# Altium schematic sheet [19]-CAMERA_PWR_CONNECTORS.SchDoc
size A4
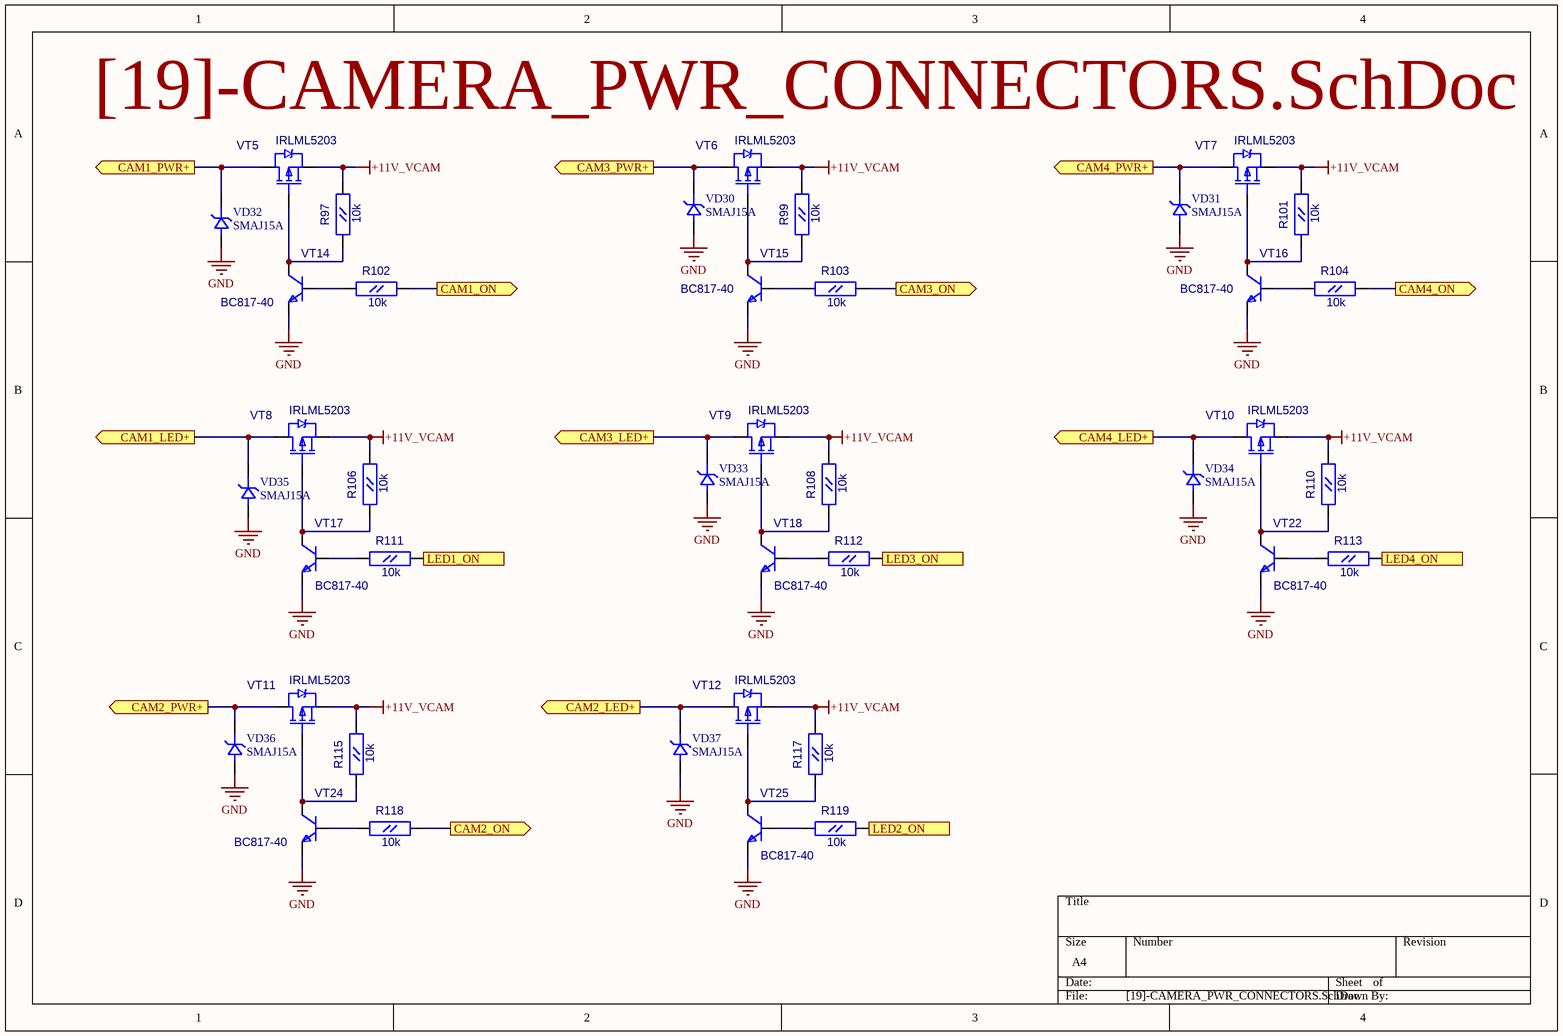
[diagram p0: [19]-CAMERA_PWR_CONNECTORS.SchDoc]

## Parts
R97  10k  [RC0603]
R99  10k  [RC0603]
R101  10k  [RC0603]
R102  10k  [RC0603]
R103  10k  [RC0603]
R104  10k  [RC0603]
R106  10k  [RC0603]
R108  10k  [RC0603]
R110  10k  [RC0603]
R111  10k  [RC0603]
R112  10k  [RC0603]
R113  10k  [RC0603]
R115  10k  [RC0603]
R117  10k  [RC0603]
R118  10k  [RC0603]
R119  10k  [RC0603]
VD30  SMAJ15A  [SMA]
VD31  SMAJ15A  [SMA]
VD32  SMAJ15A  [SMA]
VD33  SMAJ15A  [SMA]
VD34  SMAJ15A  [SMA]
VD35  SMAJ15A  [SMA]
VD36  SMAJ15A  [SMA]
VD37  SMAJ15A  [SMA]
VT5  IRLML5203  [SOT-23(123)]
VT6  IRLML5203  [SOT-23(123)]
VT7  IRLML5203  [SOT-23(123)]
VT8  IRLML5203  [SOT-23(123)]
VT9  IRLML5203  [SOT-23(123)]
VT10  IRLML5203  [SOT-23(123)]
VT11  IRLML5203  [SOT-23(123)]
VT12  IRLML5203  [SOT-23(123)]
VT14  BC817-40  [SOT-23(123)]
VT15  BC817-40  [SOT-23(123)]
VT16  BC817-40  [SOT-23(123)]
VT17  BC817-40  [SOT-23(123)]
VT18  BC817-40  [SOT-23(123)]
VT22  BC817-40  [SOT-23(123)]
VT24  BC817-40  [SOT-23(123)]
VT25  BC817-40  [SOT-23(123)]

## Ports
CAM1_LED+ (out), CAM1_ON (out), CAM1_PWR+ (out), CAM2_LED+ (out), CAM2_ON (out), CAM2_PWR+ (out), CAM3_LED+ (out), CAM3_ON (out), CAM3_PWR+ (out), CAM4_LED+ (out), CAM4_ON (out), CAM4_PWR+ (out), LED1_ON (out), LED2_ON (out), LED3_ON (out), LED4_ON (out)

## Nets
+11V_VCAM: R97.2(B) R99.2(B) R101.2(B) R106.2(B) R108.2(B) R110.2(B) R115.2(B) R117.2(B) VT5.2(S) VT6.2(S) VT7.2(S) VT8.2(S) VT9.2(S) VT10.2(S) VT11.2(S) VT12.2(S)
GND: VD30.1(A) VD31.1(A) VD32.1(A) VD33.1(A) VD34.1(A) VD35.1(A) VD36.1(A) VD37.1(A) VT14.2(E) VT15.2(E) VT16.2(E) VT17.2(E) VT18.2(E) VT22.2(E) VT24.2(E) VT25.2(E)
CAM1_LED+: VD35.2(K) VT8.3(D) ; port CAM1_LED+
CAM1_ON: R102.2(B) ; port CAM1_ON
CAM1_PWR+: VD32.2(K) VT5.3(D) ; port CAM1_PWR+
CAM2_LED+: VD37.2(K) VT12.3(D) ; port CAM2_LED+
CAM2_ON: R118.2(B) ; port CAM2_ON
CAM2_PWR+: VD36.2(K) VT11.3(D) ; port CAM2_PWR+
CAM3_LED+: VD33.2(K) VT9.3(D) ; port CAM3_LED+
CAM3_ON: R103.2(B) ; port CAM3_ON
CAM3_PWR+: VD30.2(K) VT6.3(D) ; port CAM3_PWR+
CAM4_LED+: VD34.2(K) VT10.3(D) ; port CAM4_LED+
CAM4_ON: R104.2(B) ; port CAM4_ON
CAM4_PWR+: VD31.2(K) VT7.3(D) ; port CAM4_PWR+
LED1_ON: R111.2(B) ; port LED1_ON
LED2_ON: R119.2(B) ; port LED2_ON
LED3_ON: R112.2(B) ; port LED3_ON
LED4_ON: R113.2(B) ; port LED4_ON
NetR97_1: R97.1(A) VT5.1(G) VT14.3(C)
NetR99_1: R99.1(A) VT6.1(G) VT15.3(C)
NetR101_1: R101.1(A) VT7.1(G) VT16.3(C)
NetR102_1: R102.1(A) VT14.1(B)
NetR103_1: R103.1(A) VT15.1(B)
NetR104_1: R104.1(A) VT16.1(B)
NetR106_1: R106.1(A) VT8.1(G) VT17.3(C)
NetR108_1: R108.1(A) VT9.1(G) VT18.3(C)
NetR110_1: R110.1(A) VT10.1(G) VT22.3(C)
NetR111_1: R111.1(A) VT17.1(B)
NetR112_1: R112.1(A) VT18.1(B)
NetR113_1: R113.1(A) VT22.1(B)
NetR115_1: R115.1(A) VT11.1(G) VT24.3(C)
NetR117_1: R117.1(A) VT12.1(G) VT25.3(C)
NetR118_1: R118.1(A) VT24.1(B)
NetR119_1: R119.1(A) VT25.1(B)

## Library data of the parts
R97 R99 R101-R104 R106 R108 R110-R113 R115 R117-R119 = RC0603: Value: 10k
VD30-VD37 = SMAJ: Value: SMAJ15A
VT5-VT12 = IRLML6402: HEXFET Power MOSFET; OriginalName: IRLML5103; ComponentField7: Published 8-Jun-2000; Value: IRLML5203
VT14-VT18 VT22 VT24 VT25 = BC846BLT1: NPN 500ma transistor; ComponentField7: Published 29-Sep-2000; OriginalName: BC846BLT1; Value: BC817-40